# EAGLE design ADF4351 (EAGLE 6.2)
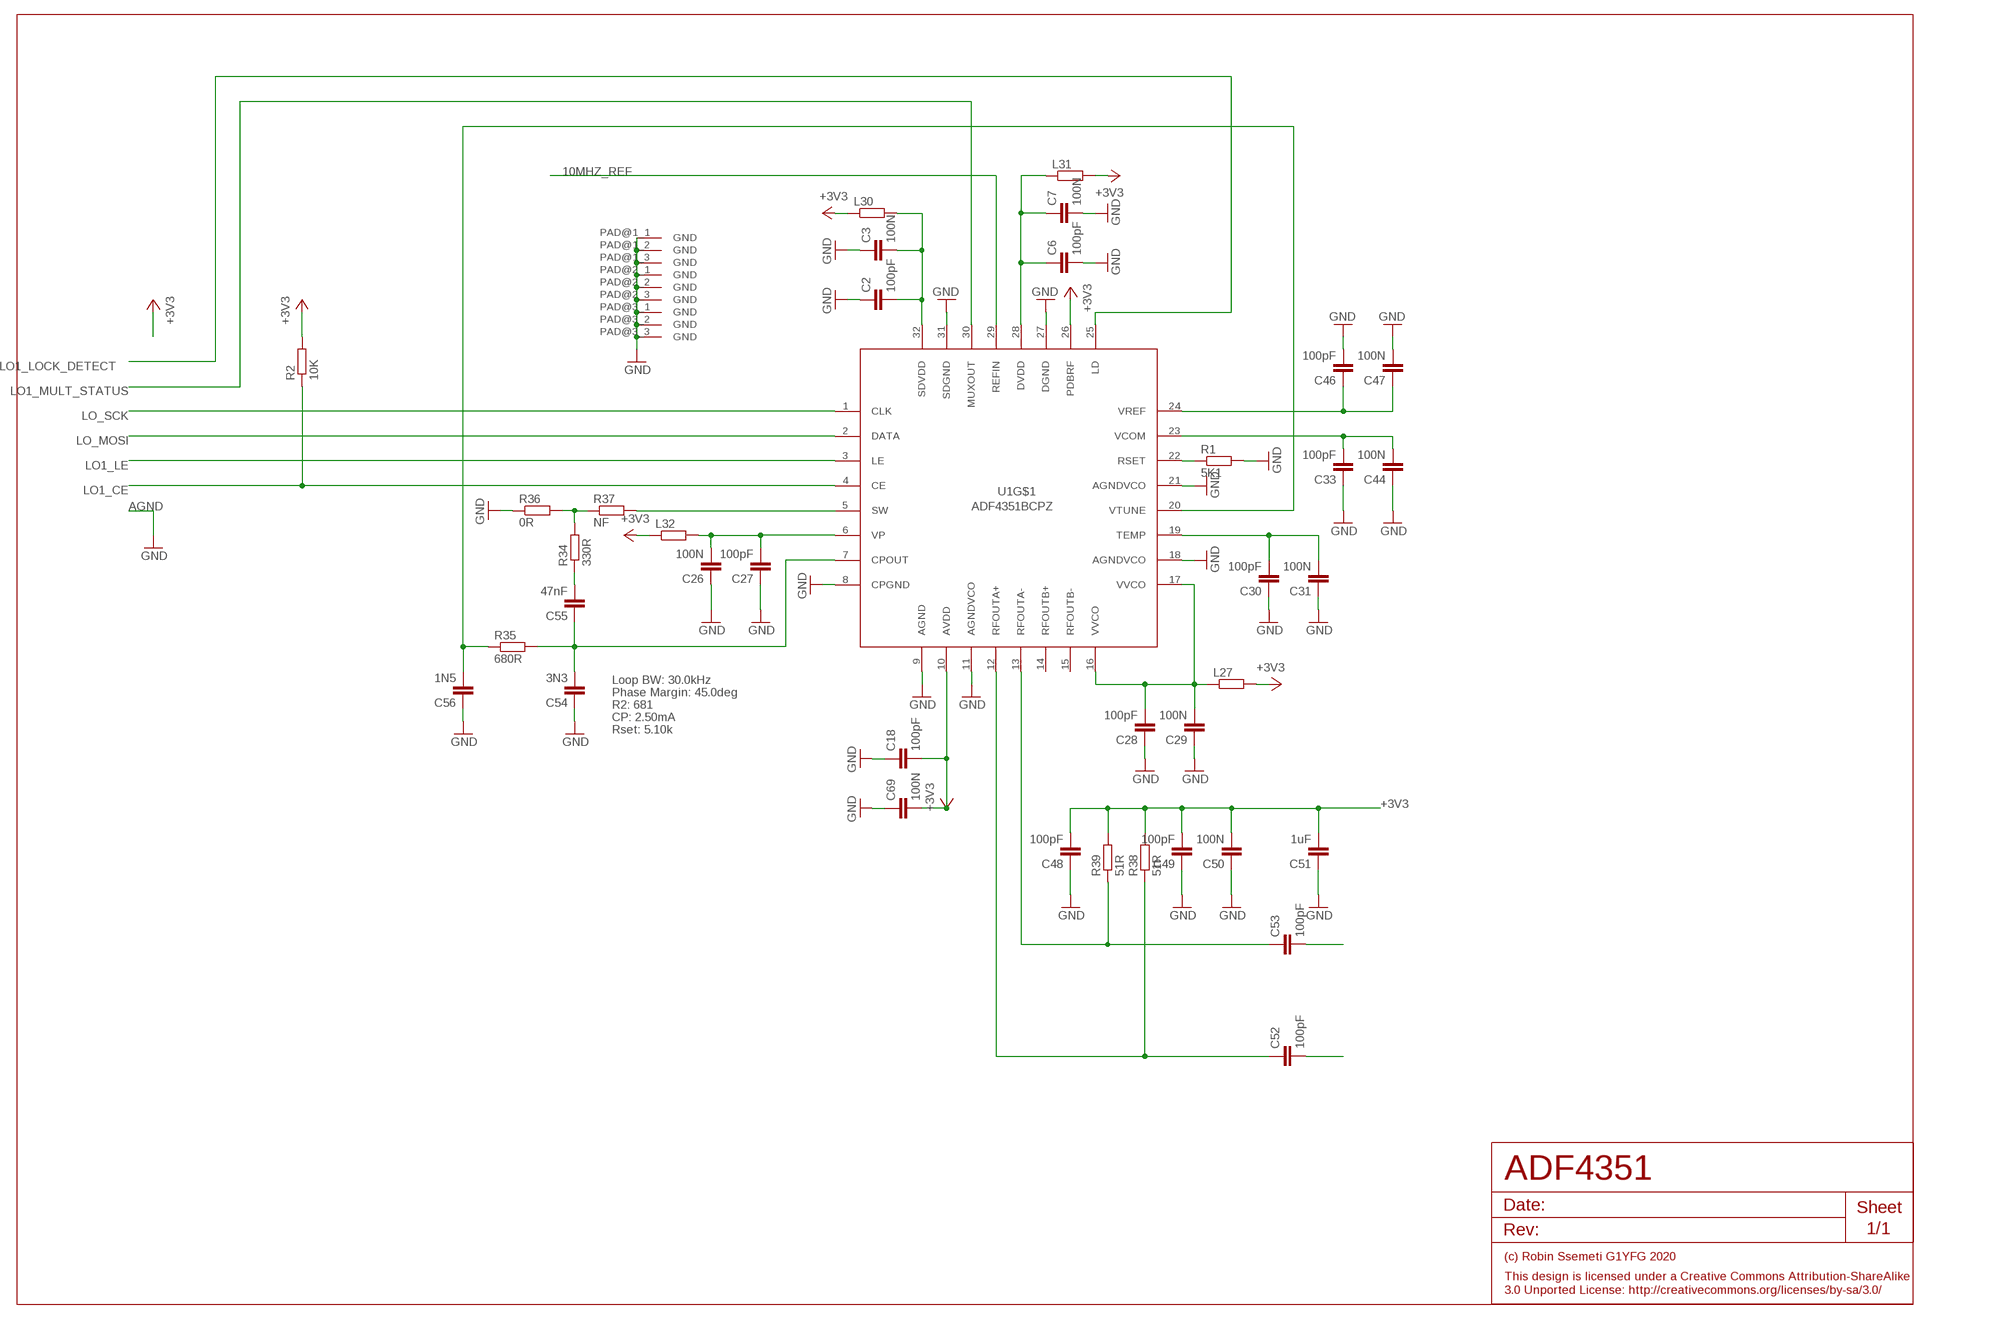
[diagram p0: schematic, sheet 1]

## Parts
C2  100pF  C-EUC0603  [C0603]
C3  100N  C-EUC0603  [C0603]
C6  100pF  C-EUC0603  [C0603]
C7  100N  C-EUC0603  [C0603]
C18  100pF  C-EUC0603  [C0603]
C26  100N  C-EUC0603  [C0603]
C27  100pF  C-EUC0603  [C0603]
C28  100pF  C-EUC0603  [C0603]
C29  100N  C-EUC0603  [C0603]
C30  100pF  C-EUC0603  [C0603]
C31  100N  C-EUC0603  [C0603]
C33  100pF  C-EUC0603  [C0603]
C44  100N  C-EUC0603  [C0603]
C46  100pF  C-EUC0603  [C0603]
C47  100N  C-EUC0603  [C0603]
C48  100pF  C-EUC0603  [C0603]
C49  100pF  C-EUC0603  [C0603]
C50  100N  C-EUC0603  [C0603]
C51  1uF  C-EUC0603  [C0603]
C52  100pF  C-EUC0603  [C0603]
C53  100pF  C-EUC0603  [C0603]
C54  3N3  C-EUC0603  [C0603]
C55  47nF  C-EUC0603  [C0603]
C56  1N5  C-EUC0603  [C0603]
C69  100N  C-EUC0603  [C0603]
L27  R-EU_R0603  [R0603]
L30  R-EU_R0603  [R0603]
L31  R-EU_R0603  [R0603]
L32  R-EU_R0603  [R0603]
R1  5K1  R-EU_R0603  [R0603]
R2  10K  R-EU_R0603  [R0603]
R34  330R  R-EU_R0603  [R0603]
R35  680R  R-EU_R0603  [R0603]
R36  0R  R-EU_R0603  [R0603]
R37  NF  R-EU_R0603  [R0603]
R38  51R  R-EU_R0603  [R0603]
R39  51R  R-EU_R0603  [R0603]
U1  ADF4351BCPZ  ADF4350BCPZ  [QFN50P500X500X100-33V2N]

## Nets
10MHZ_REF: U1.29(REFIN)
+3V3: C18.2 C48.2 C49.2 C50.2 C51.2 C69.2 L27.2 L30.1 L31.2 L32.1 R2.2 R38.2 R39.2 U1.10(AVDD) U1.26(PDBRF)
AGND: C2.1 C3.1 C6.2 C7.2 C18.1 C26.1 C27.1 C28.1 C29.1 C30.1 C31.1 C33.1 C44.1 C46.2 C47.2 C48.1 C49.1 C50.1 C51.1 C54.1 C56.1 C69.1 R1.2 R36.1 U1.8(CPGND) U1.9(AGND) U1.11(AGNDVCO) U1.18(AGNDVCO) U1.21(AGNDVCO) U1.27(DGND) U1.31(SDGND) U1.PAD@1_1(GND) U1.PAD@1_2(GND) U1.PAD@1_3(GND) U1.PAD@2_1(GND) U1.PAD@2_2(GND) U1.PAD@2_3(GND) U1.PAD@3_1(GND) U1.PAD@3_2(GND) U1.PAD@3_3(GND) ; supply symbol labelled GND
LO1_CE: R2.1 U1.4(CE)
LO1_LE: U1.3(LE)
LO1_LOCK_DETECT: U1.25(LD)
LO1_MULT_STATUS: U1.30(MUXOUT)
LO_MOSI: U1.2(DATA)
LO_SCK: U1.1(CLK)
N$2: C30.2 C31.2 U1.19(TEMP)
N$4: C33.2 C44.2 U1.23(VCOM)
N$8: C46.1 C47.1 U1.24(VREF)
N$13: C26.2 C27.2 L32.2 U1.6(VP)
N$14: C2.2 C3.2 L30.2 U1.32(SDVDD)
N$17: R1.1 U1.22(RSET)
N$18: C52.1 R38.1 U1.12(RFOUTA+)
N$19: C53.1 R39.1 U1.13(RFOUTA-)
N$28: C52.2
N$46: C54.2 C55.1 R35.2 U1.7(CPOUT)
N$47: C56.2 R35.1 U1.20(VTUNE)
N$48: C55.2 R34.1
N$49: R34.2 R36.2 R37.1
N$50: R37.2 U1.5(SW)
N$73: C6.1 C7.1 L31.1 U1.28(DVDD)
N$78: C28.2 C29.2 L27.1 U1.16(VVCO) U1.17(VVCO)
N$101 [50ohm]: C53.2
Unconnected: U1.14(RFOUTB+) U1.15(RFOUTB-)

## Notes on the sheet
- Loop BW: 30.0kHz
- Phase Margin: 45.0deg
- R2: 681
- CP: 2.50mA
- Rset: 5.10k

## Library data of the parts
C2 C3 C6 C7 C18 C26-C31 C33 C44 C46-C56 C69 = rcl:C-EU: CAPACITOR, European symbol
L27 L30-L32 R1 R34 R36 R37 = rcl:R-EU_: RESISTOR, European symbol
R2 R35 R38 R39 = resistor:R-EU_: RESISTOR, European symbol
U1 = analog_devices:ADF4350

## Net classes
1 50ohm: width 0.508 mm, clearance 0.762 mm
2 PWR: clearance 0.8 mm

## Board
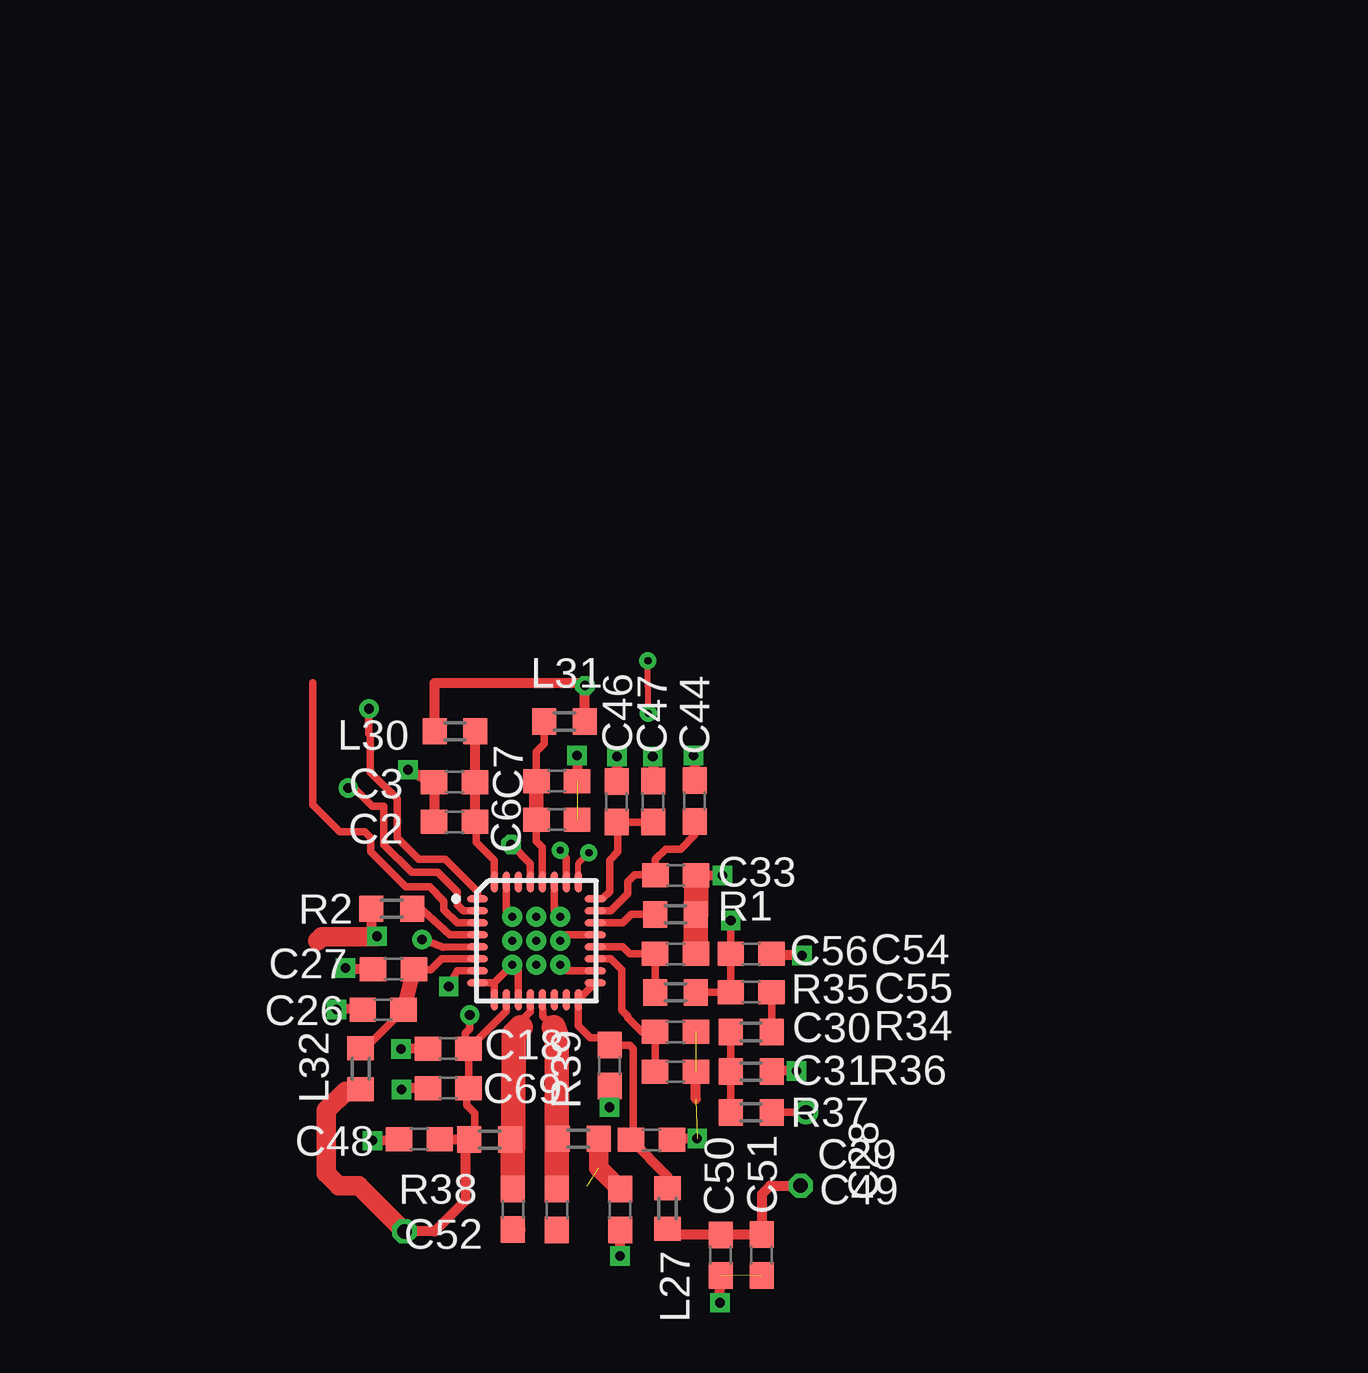
[diagram p1: board, top side]
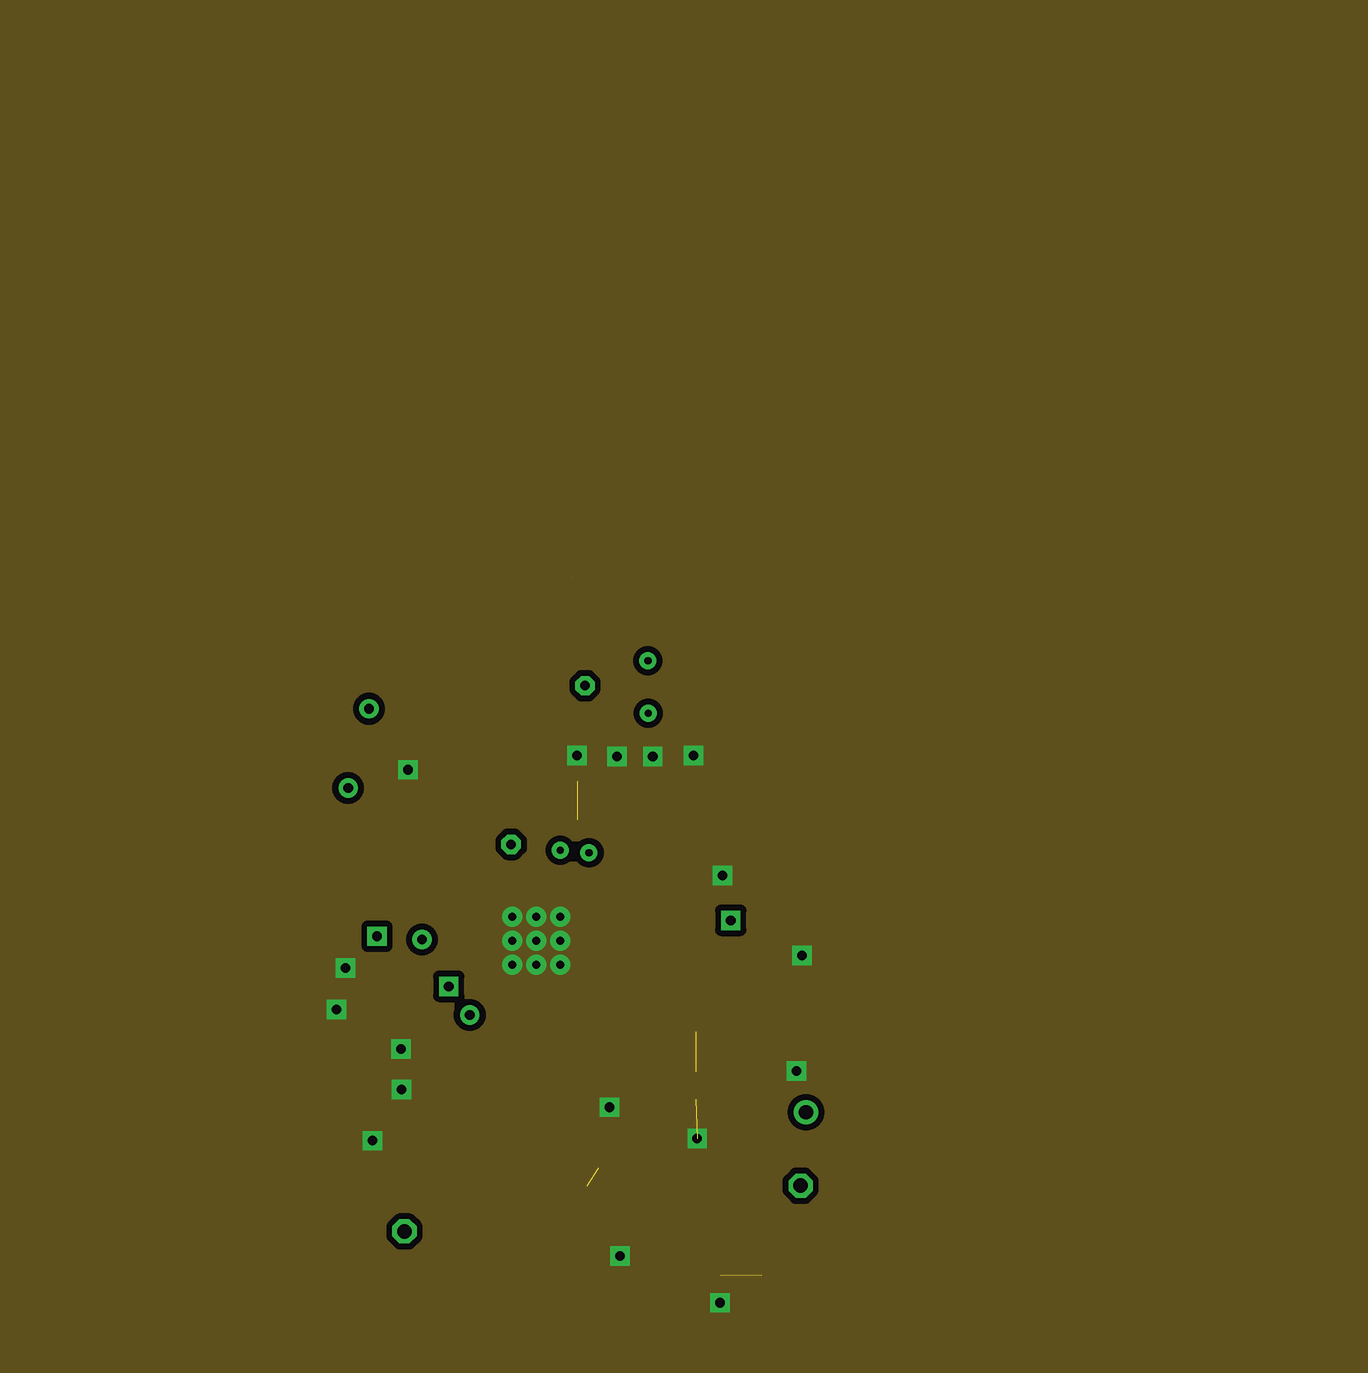
[diagram p2: board, inner layer RFEarth]
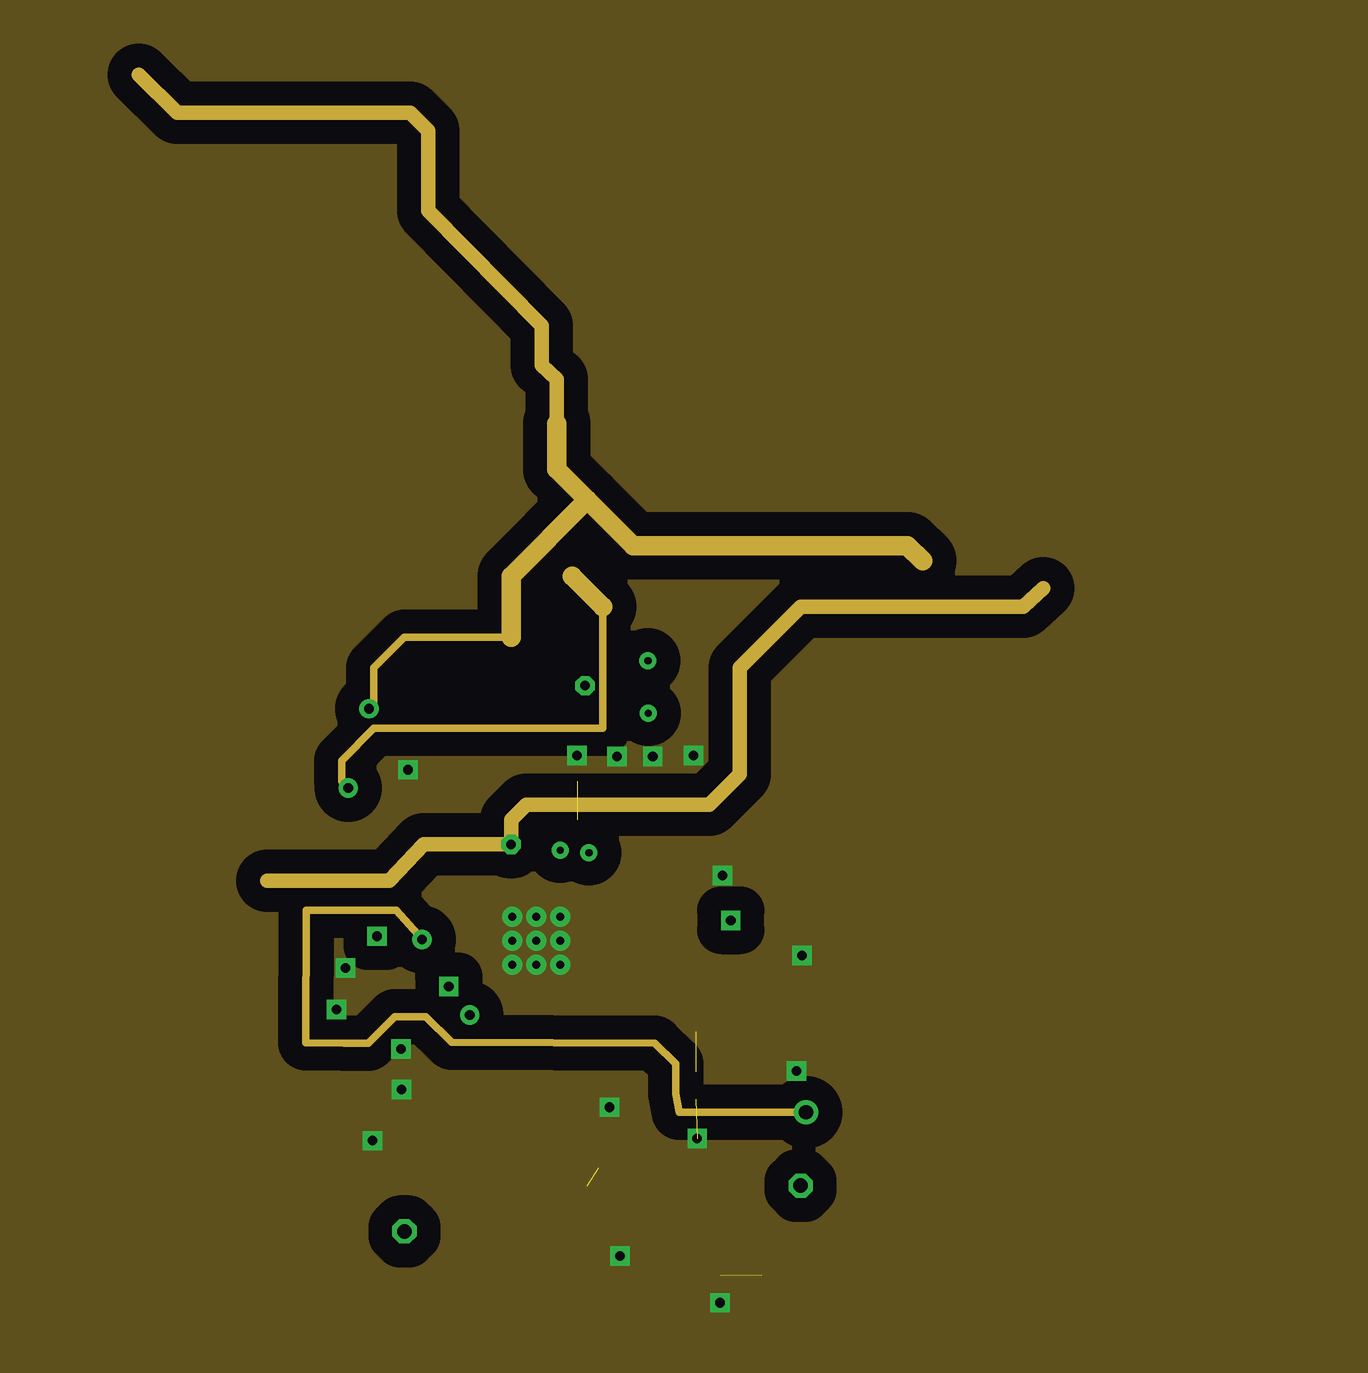
[diagram p3: board, inner layer Signal]
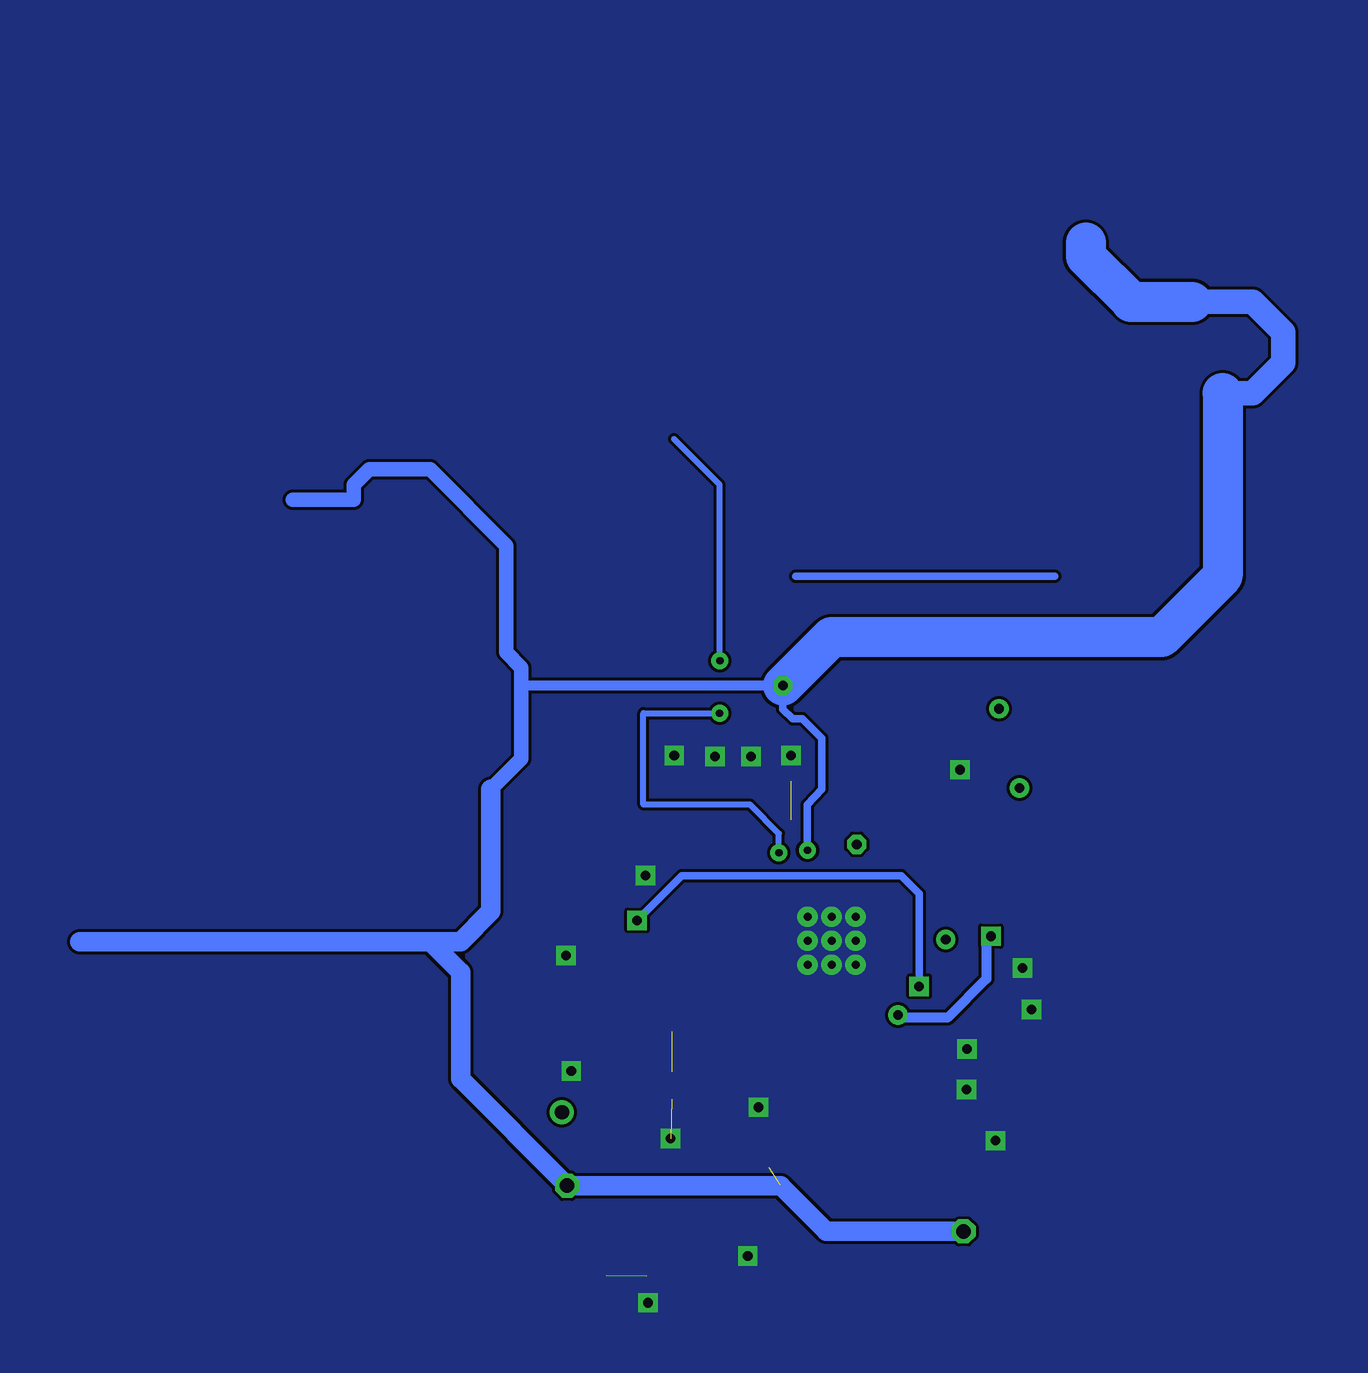
[diagram p4: board, bottom side, seen from below]

No outline drawn. Coordinates in mm, seen from the top.
Copper layers (1+2*15+16): Top 0.035mm / dielectric 1.5mm / RFEarth 0.035mm / dielectric 0.15mm / Signal 0.035mm / dielectric 0.2mm / Power 0.035mm
Design rules: minimum track width 10mil, minimum drill 0.3mm, track to track 5mil, track to pad 5mil, pad to pad 3mil, via to via 5mil, smd to smd 2mil, copper to edge 0mil, drill to drill 8mil, minimum pad ring 10mil, minimum via ring 8mil, stop-mask expansion 4mil, vias tented up to drill 0mil, thermal gap 10mil

### Footprints (pad centres in the part's own frame; a part is rotated, then mirrored left to right if it is on the bottom)
C0603 = smd 1.1 x 1: 1 -0.85,0; 2 0.85,0
R0603 = smd 1 x 1.1: 1 -0.85,0; 2 0.85,0
QFN50P500X500X100-33V2N = smd 0.9 x 0.3: 1 -2.45,1.75; 2 -2.45,1.25; 3 -2.45,0.75; 4 -2.45,0.25; 5 -2.45,-0.25; 6 -2.45,-0.75; 7 -2.45,-1.25; 8 -2.45,-1.75; 17 2.45,-1.75; 18 2.45,-1.25; 19 2.45,-0.75; 20 2.45,-0.25; 21 2.45,0.25; 22 2.45,0.75; 23 2.45,1.25; 24 2.45,1.75 | smd 0.3 x 0.9: 9 -1.75,-2.45; 10 -1.25,-2.45; 11 -0.75,-2.45; 12 -0.25,-2.45; 13 0.25,-2.45; 14 0.75,-2.45; 15 1.25,-2.45; 16 1.75,-2.45; 25 1.75,2.45; 26 1.25,2.45; 27 0.75,2.45; 28 0.25,2.45; 29 -0.25,2.45; 30 -0.75,2.45; 31 -1.25,2.45; 32 -1.75,2.45 | drill 0.33: PAD@1_1 -1,1; PAD@1_2 -1,0; PAD@1_3 -1,-1; PAD@2_1 0,1; PAD@2_2 0,0; PAD@2_3 0,-1; PAD@3_1 1,1; PAD@3_2 1,0; PAD@3_3 1,-1

### Placement (x,y rotation side)
C2  19.23,60.88 0 top
C3  19.23,62.53 0 top
C6  23.49,60.98 0 top
C7  23.49,62.58 0 top
C18  18.97,51.42 0 top
C26  16.26,53.04 0 top
C27  16.69,54.74 0 top
C28  25.69,50.73 90 top
C29  27.44,47.62 180 top
C30  28.44,52.12 180 top
C31  28.44,50.48 180 top
C33  28.45,58.66 180 top
C44  29.23,61.75 270 top
C46  25.99,61.72 90 top
C47  27.51,61.73 90 top
C48  17.77,47.65 0 top
C49  26.14,44.73 90 top
C50  30.33,42.82 90 top
C51  32.03,42.83 90 top
C52  21.66,44.74 270 top
C53  23.49,44.73 270 top
C54  31.59,55.38 180 top
C55  31.59,53.77 0 top
C56  28.44,55.38 180 top
C69  18.97,49.77 0 top
L27  28.11,44.77 270 top
L30  19.25,64.65 0 top
L31  23.82,65.06 0 top
L32  15.32,50.6 90 top
R1  28.44,57.02 0 top
R2  16.62,57.26 180 top
R34  31.59,52.12 180 top
R35  28.44,53.77 0 top
R36  31.59,50.48 180 top
R37  31.59,48.77 0 top
R38  20.7,47.64 180 top
R39  24.39,47.67 0 top
U1  22.64,55.92 0 top

### Tracks (layer width: path | path; a pad name or v marks a point on that pad's centre or on a via)
10MHZ_REF  (via drill 0.4)
  Top 0.305: U1.29 22.39,59.14 v21.59,59.94
  Signal 0.61: 11.43,58.42 16.51,58.42 17.95,59.95 v21.59,59.94 21.59,60.96 22.23,61.59 29.84,61.59 31.11,62.87 31.11,67.31 33.66,69.85 42.94,69.85 43.77,70.62
+3V3  (via drill 0.3, 0.4, 0.6)  (1 unrouted)
  Top 0.305: U1.10 21.39,52.99 C18.2 | C18.2 C69.2 19.74,49.7 19.74,49.08 20.07,48.74 20.07,47.86 R38.2 18.8,47.64 C48.2 | C18.2 19.68,51.56 19.68,52.07 19.87,52.25 v19.87,52.83 | U1.26 23.89,59.37 v23.64,59.7
  Top 0.406: C48.2 19.66,47.65 19.68,47.62 19.68,45.09 18.41,43.81 v17.14,43.81 | v33.66,45.72 32.38,45.72 32.03,45.37 C51.2 C50.2 28.36,43.67 L27.2 | L31.2 v24.67,66.55 24.55,66.67 18.41,66.67 18.4,66.66 L30.1 | R2.2 15.77,56.35 v16,56.11
  Top 0.813: v17.14,43.81 15.24,45.72 14.41,45.72 13.89,46.24 13.89,48.86 14.69,49.66 15.23,49.66 L32.1 | R39.2 25.24,46.48 C49.2 | 13.53,55.93 13.54,55.93 13.71,56.1 15.99,56.1 v16,56.11
  Power 0.305: 20.04,52.66 v19.87,52.83 | v23.64,59.7 23.65,61.6 23.04,62.23 23.04,64.36 23.86,65.17 24.26,65.17 24.67,65.58 v24.67,66.55
  Power 0.406: v24.67,66.55 35.44,66.55 35.56,66.67 | v19.87,52.83 19.75,52.72 17.8,52.72 16.19,54.33 16.19,56.01 16.11,56.01 v16,56.11
  Power 0.61: 36.83,62.23 35.56,63.5 35.56,66.67 35.56,67.31 36.2,67.94 36.2,72.39 39.37,75.56 41.91,75.56 42.55,74.93 42.55,74.3 45.09,74.3
  Power 0.813: v17.14,43.81 22.86,43.81 24.77,45.72 v33.66,45.72 38.1,50.16 38.1,54.61 39.37,55.88 | 39.37,55.88 53.98,55.88 | 39.37,55.88 38.1,55.88 36.83,57.15 36.83,62.23
  Power 1.016: 7.62,82.55 5.08,82.55 3.81,81.28 3.81,80.01 5.08,78.74 6.35,78.74
  Power 1.676: 12.04,85.02 12.04,84.43 10.16,82.55 7.62,82.55 | v24.67,66.55 22.64,68.58 8.89,68.58 6.35,71.12 6.35,78.74
AGND  (via drill 0.4)  (4 unrouted)
  Top 0.305: U1.27 23.39,57.17 U1.PAD@3_1 | U1.31 21.39,57.17 U1.PAD@1_1 | U1.21 23.89,56.17 U1.PAD@3_2 | U1.18 23.89,54.67 U1.PAD@3_3 | U1.11 21.89,54.67 U1.PAD@1_3 20.89,54.17 | U1.9 20.89,54.17 | U1.8 20.89,54.17
  Top 0.406: C26.1 14.72,53.09 v14.31,53.07 | C27.1 14.69,54.74 v14.69,54.78 | v17.3,63.05 18.24,62.53 C3.1 C2.1 | v24.33,63.65 v24.34,63.65 C7.2 | v26,63.6 v25.99,63.6 C46.2 | v27.49,63.61 27.51,63.61 C47.2 | v29.2,63.65 29.23,63.65 C44.1 | C33.1 30.4,58.66 v30.4,58.64 | v33.71,55.32 32.44,55.32 C54.1 | v33.48,50.5 32.44,50.5 R36.1 | 29.29,49.33 C31.1 | v25.68,48.99 v25.69,48.99 C28.1 | v29.34,47.69 28.29,47.69 C29.1 | v26.13,42.79 v26.14,42.79 C49.1 | v30.29,40.84 30.28,41.18 C50.1 | C48.1 16.06,47.58 v15.81,47.59 | C69.1 17.12,49.77 v17.02,49.73 | C18.1 17.12,51.42 v17,51.41
  Top 1.016: C33.1 29.3,57.03 R1.2 C56.1
  pour RFEarth (isolate 0.254, no thermals): 0.02,0.01 100.34,-0.01 100.33,100.33 0,100.33
  pour Power: 0,100.33 100.33,100.33 100.33,0 0,0
  pour Signal (isolate 1): 0,100.33 100.33,100.33 100.33,0 0,0
  pour RFEarth (isolate 0.254, no thermals): 0.02,0.01 100.34,-0.01 100.33,100.33 0,100.33
LO1_CE
  Top 0.305: U1.4 19.04,56.17 17.93,57.18 17.8,57.31 R2.1
LO1_LE
  Top 0.305: U1.3 19.34,56.67 18.79,57.23 18.79,57.58 18.19,58.17 17.19,58.17 15.74,59.62 15.74,60.23 15.49,60.48 14.46,60.48 13.34,61.59 13.34,66.67
LO1_LOCK_DETECT  (via drill 0.3)
  Top 0.254: U1.25 24.39,59.16 24.68,59.45 24.69,59.45 v24.83,59.59 | v27.3,65.41 v27.29,67.59
  Power 0.254: v24.83,59.59 24.83,60.39 26.04,61.59 30.48,61.59 30.48,65.41 v27.3,65.41 | v27.29,67.59 27.3,74.93 29.21,76.83
LO_MOSI  (via drill 0.4)  (1 unrouted)
  Top 0.305: U1.2 19.59,57.17 19.34,57.42 19.34,57.98 18.54,58.77 17.44,58.77 16.29,59.92 16.29,61.52 15.8,61.52 15.03,62.29 v14.8,62.29
  Signal 0.305: 25.4,69.85 25.4,64.77 15.88,64.77 14.53,63.42 14.53,62.57 v14.8,62.29
  Signal 0.813: 25.4,69.85 24.13,71.12
  Power 0.305: 13.34,71.12 24.13,71.12
LO_SCK  (via drill 0.4)
  Top 0.305: U1.1 20.19,57.98 18.84,59.33 17.74,59.33 16.84,60.23 16.84,61.84 15.73,62.95 15.73,64.46 15.74,64.47 15.66,64.55 v15.66,65.59
  Signal 0.305: 21.59,68.58 17.14,68.58 15.88,67.31 15.88,65.8 v15.66,65.59
  Signal 0.61: 23.5,77.47 23.5,79.33 22.87,79.91 22.87,81.56 18.13,86.34 18.13,89.68 17.39,90.42 7.68,90.42 6.08,92.01
  Signal 0.813: 23.5,77.47 23.5,75.56 24.77,74.3 | 24.77,74.3 26.67,72.39 38.1,72.39 38.73,71.75 | 21.59,68.58 21.59,71.12 24.77,74.3
N$2
  Top 0.305: U1.19 25.74,55.17 26.19,54.73 26.19,53.02 26.44,52.77 26.44,52.73 27.04,52.12 C30.2 C31.2
N$4
  Top 0.305: U1.23 25.74,57.17 26.44,57.88 26.44,58.38 26.74,58.67 27.58,58.67 C33.2 27.6,59.31 28.03,59.74 28.66,59.74 29.25,60.33 29.25,60.88 C44.2
N$8
  Top 0.305: U1.24 25.39,57.67 25.69,57.98 25.69,59.27 26.04,59.62 26.04,60.81 C46.1 27.5,60.87 C47.1
N$13
  Top 0.305: U1.6 18.7,55.17 18.25,54.72 17.56,54.72 C27.2 | L32.2 15.51,51.45 C26.2
  Top 0.61: C27.2 C26.2
N$14
  Top 0.305: U1.32 20.89,59.27 20.14,60.02 20.14,60.81 C2.2 | 20.1,62.55 C3.2
  Top 0.406: L30.2 20.08,64.64 C3.2 C2.2
N$17
  Top 0.305: U1.22 26.24,56.67 26.59,57.02 R1.1
N$18
  Top 0.305: U1.12 22.39,52.98 22.09,52.67 21.99,52.32 | R38.1 21.77,45.59 C52.1
  Top 1.016: C52.1 21.7,52.02 21.99,52.32
N$19
  Top 0.305: 23.37,52.32 22.92,52.77 U1.13 | R39.1 23.54,46.41 23.49,46.35
  Top 1.016: 23.37,52.32 23.49,51.92 23.49,46.35 C53.1 23.49,45.52
N$28
  Top 1.016: C52.2 21.68,43.88
N$46  (via drill 0.4)
  Top 0.305: R35.2 C55.1 C54.2 v30.74,56.77 | U1.7 19.34,54.67 v18.99,54.02
  Power 0.305: v18.99,54.02 18.99,57.88 19.74,58.62 28.89,58.62 v30.74,56.77
N$47
  Top 0.305: U1.20 26.24,55.67 26.54,55.38 C56.2 R35.1
N$48
  Top 0.305: R34.1 C55.2
N$49
  Top 0.305: R34.2 R36.2 R37.1
N$50  (via drill 0.4, 0.6)
  Top 0.305: U1.5 18.77,55.66 v17.88,55.98 | v33.88,48.78 R37.2
  Signal 0.305: v17.88,55.98 16.81,57.2 13.05,57.2 13.04,51.67 14.63,51.66 15.64,51.66 16.74,52.77 18.04,52.77 19.11,51.69 27.58,51.66 28.45,50.8 28.45,49.56 28.6,48.77 30.06,48.77 v33.88,48.78
N$73
  Top 0.305: U1.28 22.89,59.83 22.64,60.08 C6.1 | C7.1 22.64,63.8 22.97,64.13 L31.1 | L31.1
  Top 0.61: C7.1 C6.1
N$78
  Top 0.305: U1.17 U1.16 24.39,52.38 24.89,51.88 25.39,51.88 C28.2 26.53,51.58 26.67,51.44 26.67,47.7 C29.2
  Top 0.406: L27.1 28.11,46.11 C29.2